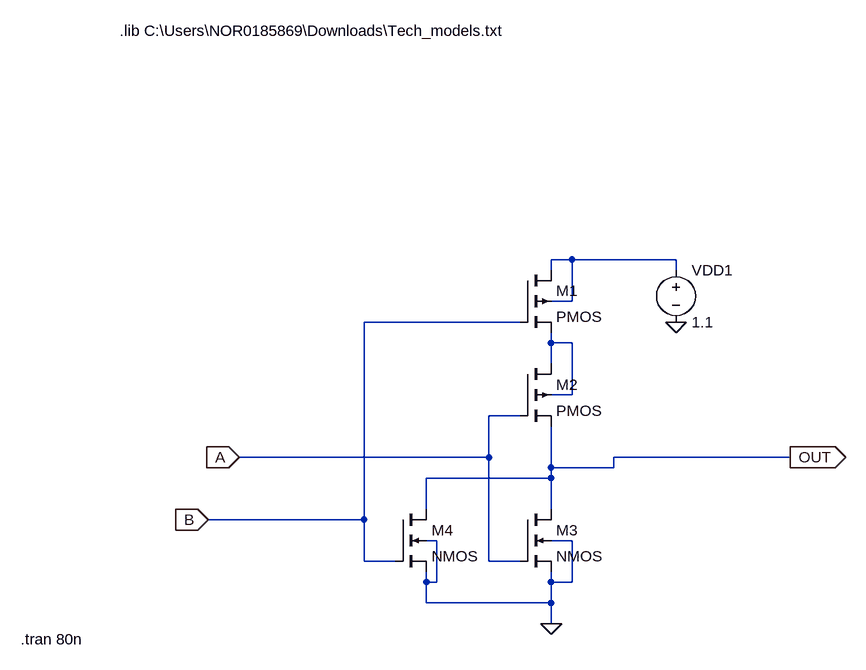
[diagram p0: schematic NORgate.asc]
NORgate.asc, the LTspice schematic file:
Version 4
SHEET 1 1184 680
WIRE 544 32 512 32
WIRE 704 32 544 32
WIRE 512 48 512 32
WIRE 704 48 704 32
WIRE 544 96 544 32
WIRE 544 96 512 96
WIRE 464 128 224 128
WIRE 512 160 512 144
WIRE 544 160 512 160
WIRE 512 192 512 160
WIRE 544 240 544 160
WIRE 544 240 512 240
WIRE 464 272 416 272
WIRE 416 336 416 272
WIRE 416 336 32 336
WIRE 880 336 608 336
WIRE 512 352 512 288
WIRE 608 352 608 336
WIRE 608 352 512 352
WIRE 512 368 512 352
WIRE 512 368 320 368
WIRE 320 416 320 368
WIRE 512 416 512 368
WIRE 224 432 224 128
WIRE 224 432 -16 432
WIRE 336 464 320 464
WIRE 544 464 512 464
WIRE 224 496 224 432
WIRE 272 496 224 496
WIRE 416 496 416 336
WIRE 464 496 416 496
WIRE 320 528 320 512
WIRE 336 528 336 464
WIRE 336 528 320 528
WIRE 512 528 512 512
WIRE 544 528 544 464
WIRE 544 528 512 528
WIRE 320 560 320 528
WIRE 512 560 512 528
WIRE 512 560 320 560
WIRE 512 592 512 560
FLAG 512 592 0
FLAG 704 128 0
FLAG 880 336 OUT
IOPIN 880 336 Out
FLAG 32 336 A
IOPIN 32 336 In
FLAG -16 432 B
IOPIN -16 432 In
SYMBOL pmos4 464 48 R0
SYMATTR InstName M1
SYMATTR Value2 l=32n w=128n
SYMBOL pmos4 464 192 R0
SYMATTR InstName M2
SYMATTR Value2 l=32n w=128n
SYMBOL nmos4 464 416 R0
SYMATTR InstName M3
SYMATTR Value2 l=32n w=64n
SYMBOL nmos4 272 416 R0
SYMATTR InstName M4
SYMATTR Value2 l=32n w=64n
SYMBOL voltage 704 32 R0
WINDOW 123 0 0 Left 0
WINDOW 39 0 0 Left 0
SYMATTR InstName VDD1
SYMATTR Value 1.1
TEXT -152 -320 Left 2 !.lib C:\\Users\\NOR0185869\\Downloads\\Tech_models.txt
TEXT -304 616 Left 2 !.tran 80n

The netlist it stands for:
* NORgate.asc
M1 N001 B N002 N001 PMOS l=32n w=128n
M2 N002 A OUT N002 PMOS l=32n w=128n
M3 OUT A 0 0 NMOS l=32n w=64n
M4 OUT B 0 0 NMOS l=32n w=64n
VDD1 N001 0 1.1
.model NMOS NMOS
.model PMOS PMOS
.lib standard.mos
.lib C:\Users\NOR0185869\Downloads\Tech_models.txt
.tran 80n
.backanno
.end